# Altium project DRV8301_project.PrjPcb
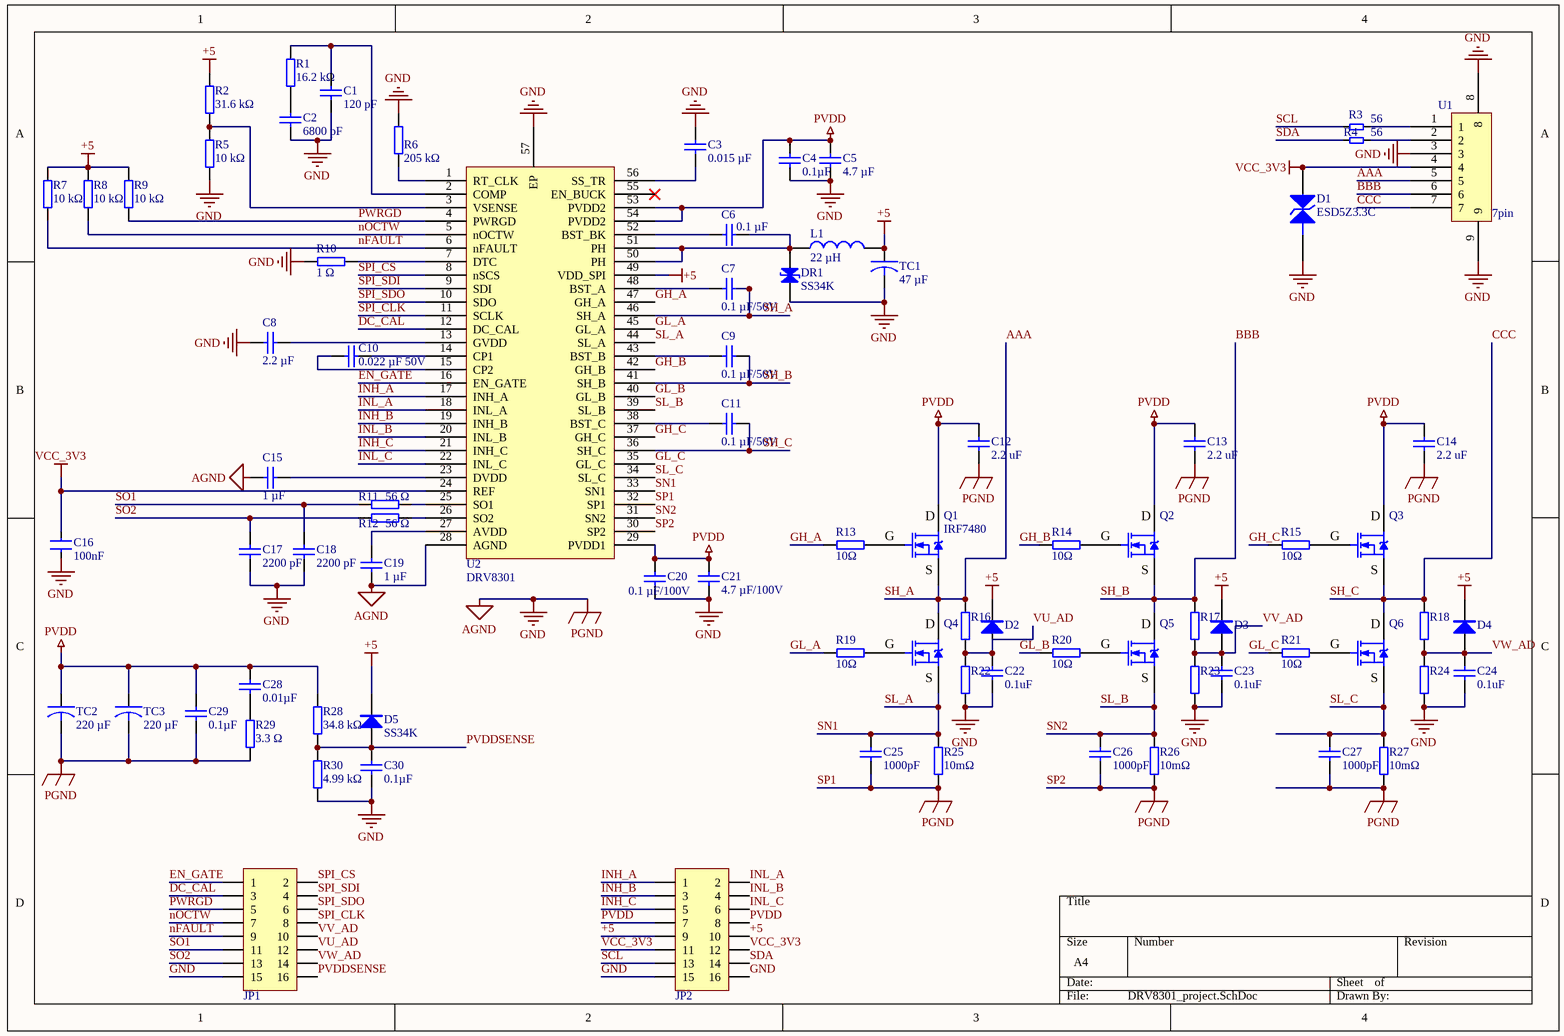
[diagram p0: DRV8301_project.SchDoc]
1 sheet, 80 parts. Net scope: global (net labels, ports and power ports of the same name join across sheets).
Board file: DRV8301.PcbDoc

## Sheet DRV8301_project.SchDoc
size A4

### Parts
C1  120 pF  [C 0603_L]
C2  6800 pF  [C 0603_L]
C3  0.015 µF  [C 0603_L]
C4  0.1µF  [C 0603_L]
C5  4.7 µF  [C 0603_L]
C6  0.1 µF  [C 0603_L]
C7  0.1 µF/50V  [C 0603_L]
C8  2.2 µF  [C 0603_L]
C9  0.1 µF/50V  [C 0603_L]
C10  0.022 µF 50V  [C 0603_L]
C11  0.1 µF/50V  [C 0603_L]
C12  2.2 uF  [C 0603_L]
C13  2.2 uF  [C 0603_L]
C14  2.2 uF  [C 0603_L]
C15  1 µF  [C 0603_L]
C16  100nF  [C 0603_L]
C17  2200 pF  [C 0603_L]
C18  2200 pF  [C 0603_L]
C19  1 µF  [C 0603_L]
C20  0.1 µF/100V  [C 0603_L]
C21  4.7 µF/100V  [C 0603_L]
C22  0.1uF  [C 0603_L]
C23  0.1uF  [C 0603_L]
C24  0.1uF  [C 0603_L]
C25  1000pF  [C 0603_L]
C26  1000pF  [C 0603_L]
C27  1000pF  [C 0603_L]
C28  0.01µF  [C 0603_L]
C29  0.1µF  [C 0603_L]
C30  0.1µF  [C 0603_L]
D1  ESD5Z3.3C  [R 0603_L]
D2  SS34K  [SMA]  (value not drawn)
D3  SS34K  [SMA]  (value not drawn)
D4  SS34K  [SMA]  (value not drawn)
D5  SS34K  [SMA]
DR1  SS34K  [SMA]
JP1  Header 8X2  [HDR2X8]  (value not drawn)
JP2  Header 8X2  [HDR2X8]  (value not drawn)
L1  22 µH  [CDRH74]
Q1  IRF7480  [IRF7480MTRPBF-3pin]
Q2  IRF7480  [IRF7480MTRPBF-3pin]  (value not drawn)
Q3  IRF7480  [IRF7480MTRPBF-3pin]  (value not drawn)
Q4  IRF7480  [IRF7480MTRPBF-3pin]  (value not drawn)
Q5  IRF7480  [IRF7480MTRPBF-3pin]  (value not drawn)
Q6  IRF7480  [IRF7480MTRPBF-3pin]  (value not drawn)
R1  16.2 kΩ  [R 0603_L]
R2  31.6 kΩ  [R 0603_L]
R3  56  [R 0603_L]
R4  56  [R 0603_L]
R5  10 kΩ  [R 0603_L]
R6  205 kΩ  [R 0603_L]
R7  10 kΩ  [R 0603_L]
R8  10 kΩ  [R 0603_L]
R9  10 kΩ  [R 0603_L]
R10  1 Ω  [R 0603_L]
R11  56 Ω  [R 0603_L]
R12  56 Ω  [R 0603_L]
R13  10Ω  [R 0603_L]
R14  10Ω  [R 0603_L]
R15  10Ω  [R 0603_L]
R16  34.8 kΩ  [R 0603_L]  (value not drawn)
R17  RES  [R 0603_L]  (value not drawn)
R18  RES  [R 0603_L]  (value not drawn)
R19  10Ω  [R 0603_L]
R20  10Ω  [R 0603_L]
R21  10Ω  [R 0603_L]
R22  4.99 kΩ  [R 0603_L]  (value not drawn)
R23  RES  [R 0603_L]  (value not drawn)
R24  RES  [R 0603_L]  (value not drawn)
R25  10mΩ  [R 0603_L]
R26  10mΩ  [R 0603_L]
R27  10mΩ  [R 0603_L]
R28  34.8 kΩ  [R 0603_L]
R29  3.3 Ω  [R 0603_L]
R30  4.99 kΩ  [R 0603_L]
TC1  47 µF  [C 1210_L]
TC2  220 µF  [CT 6*6 - V]
TC3  220 µF  [CT 6*6 - R]
U1  7pin  [HC-1.0-7PWT]
U2  DRV8301  [SSOP56]

### Nets
+5: D2.2(K) D3.2(K) D4.2(K) D5.2(K) JP2.9 JP2.10 L1.2 R2.2 R7.2 R8.2 R9.2 TC1.1 U2.49(VDD_SPI)
GND: C1.2 C2.2 C3.2 C4.2 C5.2 C8.2 C12.2 C13.2 C14.2 C15.1 C16.2 C17.2 C18.2 C19.1 C20.2 C21.2 C22.2 C23.2 C24.2 C25.2 C26.2 C27.2 C29.2 C30.2 D1.1(A) DR1.2(K) JP1.15 JP2.15 JP2.16 R5.1 R6.2 R10.1 R22.1 R23.1 R24.1 R25.1 R26.1 R27.1 R29.1 R30.1 TC1.2 TC2.2 TC3.2 U1.3 U1.8 U1.9 U2.28(AGND) U2.30(SP2) U2.32(SP1) U2.57(EP)  [also labelled AGND, PGND, SP1, SP2]
PVDD: C4.1 C5.1 C12.1 C13.1 C14.1 C20.1 C21.1 C28.1 C29.1 JP2.7 JP2.8 Q1.3(D) Q2.3(D) Q3.3(D) R28.2 TC2.1 TC3.1 U2.29(PVDD1) U2.53(PVDD2) U2.54(PVDD2)
VCC_3V3: C16.1 D1.2(K) JP2.11 JP2.12 U1.4 U2.24(REF)
AAA: C7.1 Q1.2(S) Q4.3(D) R16.2 U1.5 U2.46(SH_A)  [also labelled SH_A]
BBB: C9.2 Q2.2(S) Q5.3(D) R17.2 U1.6 U2.41(SH_B)  [also labelled SH_B]
CCC: C11.2 Q3.2(S) Q6.3(D) R18.2 U1.7 U2.36(SH_C)  [also labelled SH_C]
DC_CAL: JP1.3 U2.12(DC_CAL)
EN_GATE: JP1.1 U2.16(EN_GATE)
GH_A: R13.1 U2.47(GH_A)
GH_B: R14.1 U2.42(GH_B)
GH_C: R15.1 U2.37(GH_C)
GL_A: R19.1 U2.45(GL_A)
GL_B: R20.1 U2.40(GL_B)
GL_C: R21.1 U2.35(GL_C)
INH_A: JP2.1 U2.17(INH_A)
INH_B: JP2.3 U2.19(INH_B)
INH_C: JP2.5 U2.21(INH_C)
INL_A: JP2.2 U2.18(INL_A)
INL_B: JP2.4 U2.20(INL_B)
INL_C: JP2.6 U2.22(INL_C)
nFAULT: JP1.9 R7.1 U2.6(nFAULT)
nOCTW: JP1.7 R8.1 U2.5(nOCTW)
PVDDSENSE: C30.1 D5.1(A) JP1.16 R28.1 R30.2
PWRGD: JP1.5 R9.1 U2.4(PWRGD)
SCL: JP2.13 R3.1
SDA: JP2.14 R4.1
SL_A: C25.1 Q4.2(S) R25.2 U2.33(SN1) U2.44(SL_A)  [also labelled SN1]
SL_B: C26.1 Q5.2(S) R26.2 U2.31(SN2) U2.39(SL_B)  [also labelled SN2]
SL_C: C27.1 Q6.2(S) R27.2 U2.34(SL_C)
SO1: C18.1 JP1.11 R11.1
SO2: C17.1 JP1.13 R12.1
SPI_CLK: JP1.8 U2.11(SCLK)
SPI_CS: JP1.2 U2.8(nSCS)
SPI_SDI: JP1.4 U2.9(SDI)
SPI_SDO: JP1.6 U2.10(SDO)
VU_AD: C22.1 D2.1(A) JP1.12 R16.1 R22.2
VV_AD: C23.1 D3.1(A) JP1.10 R17.1 R23.2
VW_AD: C24.1 D4.1(A) JP1.14 R18.1 R24.2
NetC1_1: C1.1 R1.2 U2.2(COMP)
NetC2_1: C2.1 R1.1
NetC3_1: C3.1 U2.56(SS_TR)
NetC6_1: C6.1 U2.52(BST_BK)
NetC6_2: C6.2 DR1.1(A) L1.1 U2.50(PH) U2.51(PH)
NetC7_2: C7.2 U2.48(BST_A)
NetC8_1: C8.1 U2.13(GVDD)
NetC9_1: C9.1 U2.43(BST_B)
NetC10_1: C10.1 U2.15(CP2)
NetC10_2: C10.2 U2.14(CP1)
NetC11_1: C11.1 U2.38(BST_C)
NetC15_2: C15.2 U2.23(DVDD)
NetC19_2: C19.2 U2.27(AVDD)
NetC28_2: C28.2 R29.2
NetQ1_1: Q1.1(G) R13.2
NetQ2_1: Q2.1(G) R14.2
NetQ3_1: Q3.1(G) R15.2
NetQ4_1: Q4.1(G) R19.2
NetQ5_1: Q5.1(G) R20.2
NetQ6_1: Q6.1(G) R21.2
NetR2_1: R2.1 R5.2 U2.3(VSENSE)
NetR3_2: R3.2 U1.1
NetR4_2: R4.2 U1.2
NetR6_1: R6.1 U2.1(RT_CLK)
NetR10_2: R10.2 U2.7(DTC)
NetR11_2: R11.2 U2.25(SO1)
NetR12_2: R12.2 U2.26(SO2)

Not connected (* = marked no-connect by the designer): U2 55(EN_BUCK)*

### Library data of the parts
C1-C7 C9 C11-C15 C17-C30 = CAP
C8 = CAP: 2.2 µF  陶瓷电容。大于16V
C10 = CAP: 耐压值要高的陶瓷电容，等于V PIDD1
C16 = C0603: 电容
D1 = ESD: ESD管
D2-D5 = SS34: 肖特基二极管; 版权归属: 源创客; 属性: 40V/3A; BOM名称: 肖特基二极管; 学习资源: www.ooocke.com
DR1 = DR: 瞬态电压抑制二极管; 版权归属: 源创客; BOM名称: 瞬态电压抑制二极管; 学习资源: www.ooocke.com
JP1 JP2 = Header 8X2: 8*2P接插件; 版权归属: 源创客; BOM名称: 8*2P接插件; 学习资源: www.ooocke.com
L1 = L: 电感; BOM名称: 小功率贴片电感; 版权归属: 源创客; 学习资源: www.ooocke.com
Q1-Q6 = IRF7480: N沟场效应管; 版权归属: 源创客; BOM名称: N沟场效应管; 学习资源: www.ooocke.com
R1 R2 R5-R16 R19-R22 R25-R30 = RES
R3 R4 = R0603: 电阻
TC1-TC3 = CAP-TC
U1 = connect_7pin: HC-1.0-7PWT